# Altium schematic sheet GSM-Arduino-Custom-Board.SchDoc
size A2; Organization: Altium Limited; Address1: L3, 12a Rodborough Rd; Address2: Frenchs Forest; Address3: NSW; Address4: Australia 2086
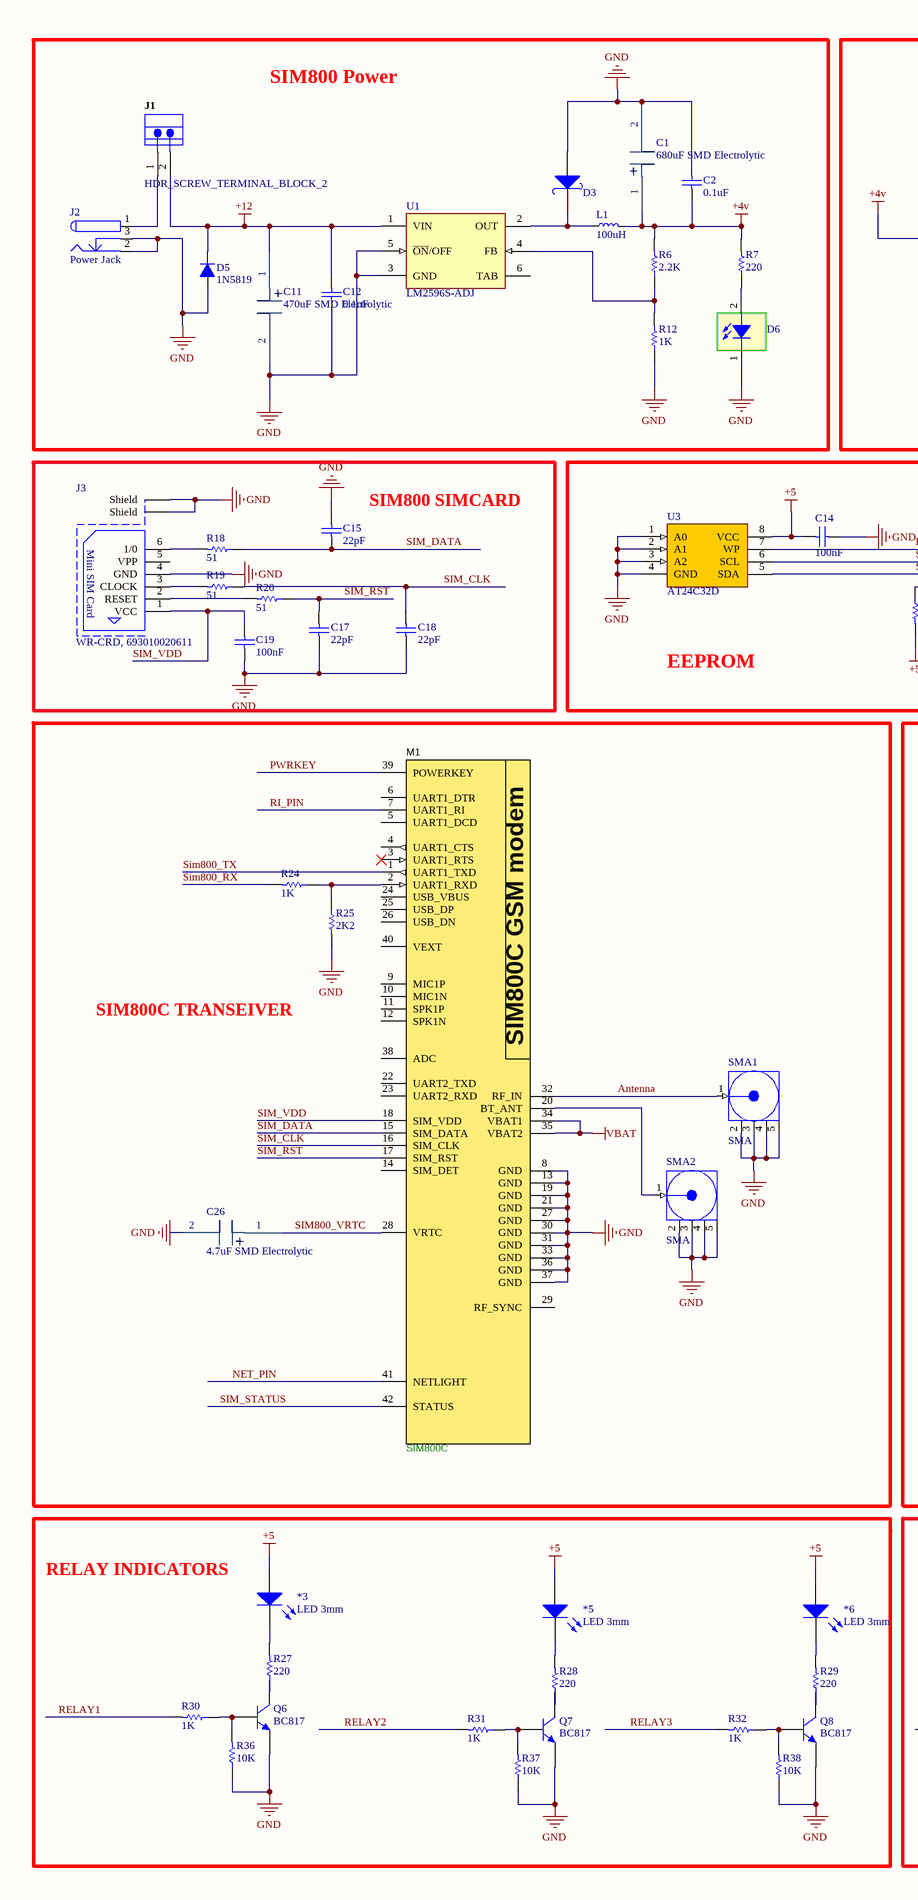
[diagram p0: GSM-Arduino-Custom-Board.SchDoc, left]
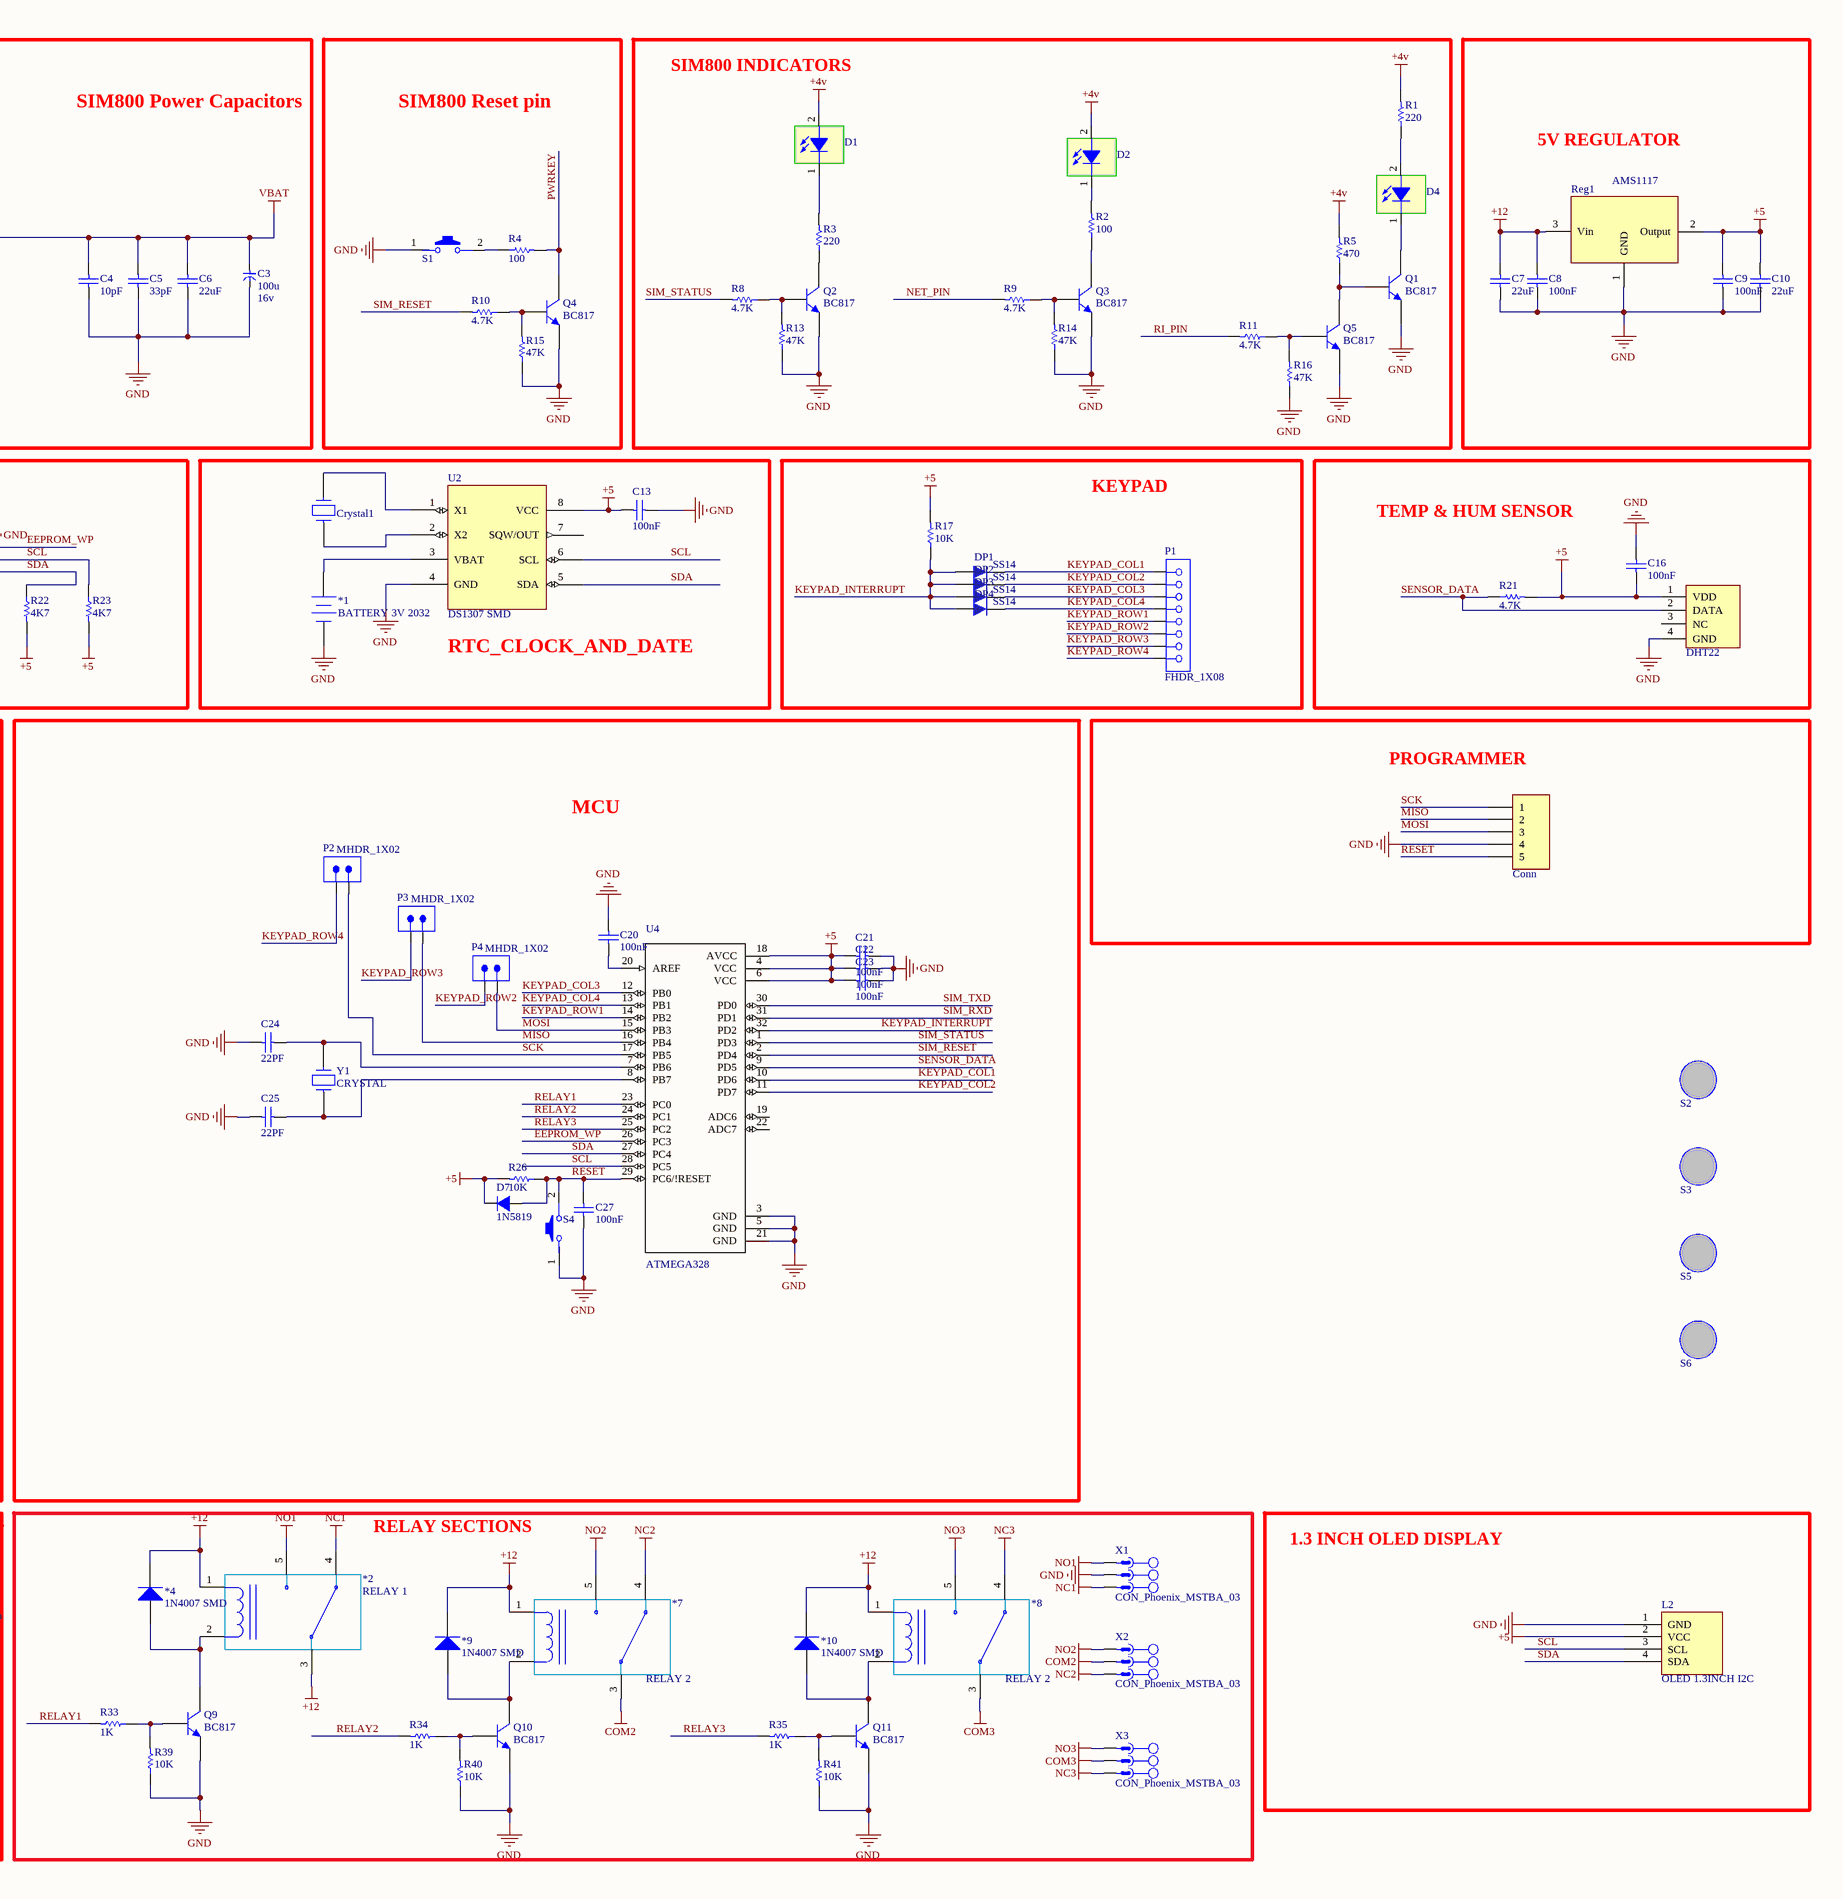
[diagram p1: GSM-Arduino-Custom-Board.SchDoc, right]

## Parts
*1  BATTERY 3V 2032  [batt]
*2  RELAY 1  [relay 3]
*3  LED 3mm  [led 3mm]
*4  1N4007 SMD  [1N4007 SMD]
*5  LED 3mm  [led 3mm]
*6  LED 3mm  [led 3mm]
*7  RELAY 2  [relay 3]
*8  RELAY 2  [relay 3]
*9  1N4007 SMD  [1N4007 SMD]
*10  1N4007 SMD  [1N4007 SMD]
C1  680uF SMD Electrolytic  [SMD Electrolytic Capacitor 8 x 10.2]
C2  0.1uF  [CAPC4817X12N]
C3  100u  Power: 16v  [TANTAL CAPACITOR SMD B]
C4  10pF  [CAPC4817X12N]
C5  33pF  [CAPC4817X12N]
C6  22uF  [CAPC4817X12N]
C7  22uF  [CAPC4817X12N]
C8  100nF  [CAPC4817X12N]
C9  100nF  [CAPC4817X12N]
C10  22uF  [CAPC4817X12N]
C11  470uF SMD Electrolytic  [SMD Electrolytic Capacitor 8 x 10.2]
C12  0.1uF  [CAPC4817X12N]
C13  100nF  [CAPC4817X12N]
C14  100nF  [CAPC4817X12N]
C15  22pF  [CAPC4817X12N]
C16  100nF  [CAPC4817X12N]
C17  22pF  [CAPC4817X12N]
C18  22pF  [CAPC4817X12N]
C19  100nF  [CAPC4817X12N]
C20  100nF  [CAPC4817X12N]
C21  100nF  [CAPC4817X12N]
C22  100nF  [CAPC4817X12N]
C23  100nF  [CAPC4817X12N]
C24  22PF  [CAPC4817X12N]
C25  22PF  [CAPC4817X12N]
C26  4.7uF SMD Electrolytic  [SMD Electrolytic Capacitor 4x5.2]
C27  100nF  [CAPC4817X12N]
Conn  Telecommunications  [Teleconn_5pin]  (value not drawn)
Crystal1  Crystal  [Crystal_2]  (value not drawn)
D1  SMD 1206 LED  [LED 1206]  (value not drawn)
D2  SMD 1206 LED  [LED 1206]  (value not drawn)
D3  1n5822  [DO-214AB(SMC)]  (value not drawn)
D4  SMD 1206 LED  [LED 1206]  (value not drawn)
D5  1N5819  [DO-214AC]
D6  SMD 1206 LED  [LED 1206]  (value not drawn)
D7  1N5819  [DO-214AC]
DHT22  DHT22  [DHT22]  (value not drawn)
DP1  SS14  [430X270D]
DP2  SS14  [430X270D]
DP3  SS14  [430X270D]
DP4  SS14  [430X270D]
J1  HDR_SCREW_TERMINAL_BLOCK_2  [Socket Blue 2]
J2  Power Jack  [Power Jack]
J3  WR-CRD, 693010020611  [693010020611]
L1  100uH  [inductor smd]
L2  OLED 1.3INCH I2C  [OLED 1.3INCH I2C]
M1  SIM800C  [SIM800C]
P1  FHDR_1X08  [FHDR1X08-254P]
P2  MHDR_1X02  [MHDR1X02-254P]
P3  MHDR_1X02  [MHDR1X02-254P]
P4  MHDR_1X02  [MHDR1X02-254P]
Q1  BC817  [SOT23_N]
Q2  BC817  [SOT23_N]
Q3  BC817  [SOT23_N]
Q4  BC817  [SOT23_N]
Q5  BC817  [SOT23_N]
Q6  BC817  [SOT23_N]
Q7  BC817  [SOT23_N]
Q8  BC817  [SOT23_N]
Q9  BC817  [SOT23_N]
Q10  BC817  [SOT23_N]
Q11  BC817  [SOT23_N]
R1  220  [RESC4817X04N]
R2  100  [RESC4817X04N]
R3  220  [RESC4817X04N]
R4  100  [RESC4817X04N]
R5  470  [RESC4817X04N]
R6  2.2K  [RESC4817X04N]
R7  220  [RESC4817X04N]
R8  4.7K  [RESC4817X04N]
R9  4.7K  [RESC4817X04N]
R10  4.7K  [RESC4817X04N]
R11  4.7K  [RESC4817X04N]
R12  1K  [RESC4817X04N]
R13  47K  [RESC4817X04N]
R14  47K  [RESC4817X04N]
R15  47K  [RESC4817X04N]
R16  47K  [RESC4817X04N]
R17  10K  [RESC4817X04N]
R18  51  [RESC4817X04N]
R19  51  [RESC4817X04N]
R20  51  [RESC4817X04N]
R21  4.7K  [RESC4817X04N]
R22  4K7  [RESC4817X04N]
R23  4K7  [RESC4817X04N]
R24  1K  [RESC4817X04N]
R25  2K2  [RESC4817X04N]
R26  10K  [RESC4817X04N]
R27  220  [RESC4817X04N]
R28  220  [RESC4817X04N]
R29  220  [RESC4817X04N]
R30  1K  [RESC4817X04N]
R31  1K  [RESC4817X04N]
R32  1K  [RESC4817X04N]
R33  1K  [RESC4817X04N]
R34  1K  [RESC4817X04N]
R35  1K  [RESC4817X04N]
R36  10K  [RESC4817X04N]
R37  10K  [RESC4817X04N]
R38  10K  [RESC4817X04N]
R39  10K  [RESC4817X04N]
R40  10K  [RESC4817X04N]
R41  10K  [RESC4817X04N]
Reg1  AMS1117  [AMS1117 3.3]
S1  SW_PB2  [SMD_ALPS_SKQMBBE010]  (value not drawn)
S2  Screw  [MY_PAD_3MM]  (value not drawn)  (net tie, no BOM)
S3  Screw  [MY_PAD_3MM]  (value not drawn)  (net tie, no BOM)
S4  SW_PB2  [SMD_ALPS_SKQMBBE010]  (value not drawn)
S5  Screw  [MY_PAD_3MM]  (value not drawn)  (net tie, no BOM)
S6  Screw  [MY_PAD_3MM]  (value not drawn)  (net tie, no BOM)
SMA1  SMA  [SMA ANT]
SMA2  SMA  [SMA ANT]
U1  LM2596S-ADJ  [TS5B_N]
U2  DS1307 SMD  [DS1307 SMD - SO-8]
U3  AT24C32D  [SO8]
U4  ATMEGA328  [QFP80P900X900X120-32N]
X1  CON_Phoenix_MSTBA_03  [CON_MSTBA03]
X2  CON_Phoenix_MSTBA_03  [CON_MSTBA03]
X3  CON_Phoenix_MSTBA_03  [CON_MSTBA03]
Y1  CRYSTAL  [My_Crystal_SMD]

## Blocks framed on the sheet
SIM800 Power: C1 C2 C11 C12 D3 D5 D6 J1 J2 L1 R6 R7 R12 U1
SIM800 Power Capacitors: C3-C6
SIM800 Reset pin: Q4 R4 R10 R15 S1
SIM800 INDICATORS: D1 D2 D4 Q1-Q3 Q5 R1-R3 R5 R8 R9 R11 R13 R14 R16
5V REGULATOR: C7-C10 Reg1
SIM800 SIMCARD: C15 C17-C19 J3 R18-R20
EEPROM: C14 R22 R23 U3
RTC_CLOCK_AND_DATE: *1 C13 Crystal1 U2
KEYPAD: DP1-DP4 P1 R17
TEMP & HUM SENSOR: C16 DHT22 R21
SIM800C TRANSEIVER: C26 M1 R24 R25 SMA1 SMA2
MCU: C20-C25 C27 D7 P2-P4 R26 S4 U4 Y1
PROGRAMMER: Conn
RELAY INDICATORS: *3 *5 *6 Q6-Q8 R27-R32 R36-R38
RELAY SECTIONS: *2 *4 *7-*10 Q9-Q11 R33-R35 R39-R41 X1-X3
1.3 INCH OLED DISPLAY: L2

## Nets
+4v: C1.1 C2.1 C3.1 C4.2 C5.2 C6.2 D1.2 D2.2 L1.2 M1.34(VBAT1) M1.35(VBAT2) R1.2 R5.2 R6.2 R7.2  [also labelled VBAT]
+5: *3.1(A) *5.1(A) *6.1(A) C9.2 C10.2 C13.2 C14.2 C16.1 C21.2 C22.2 C23.2 D7.1 DHT22.1(VDD) L2.2(VCC) R17.2 R21.2 R22.2 R23.2 R26.2 Reg1.2(Output) U2.8(VCC) U3.8(VCC) U4.4(VCC) U4.6(VCC) U4.18(AVCC)
+12: *2.1 *2.3 *4.2(K) *7.1 *8.1 *9.2(K) *10.2(K) C7.2 C8.2 C11.1 C12.2 D5.1 J1.2 Reg1.3(Vin) U1.1(VIN)
COM2: *7.3 X2.2
COM3: *8.3 X3.2
GND: *1.2(-) C1.2 C2.2 C3.2 C4.1 C5.1 C6.1 C7.1 C8.1 C9.1 C10.1 C11.2 C12.1 C13.1 C14.1 C15.1 C16.2 C17.2 C18.2 C19.1 C20.1 C21.1 C22.1 C23.1 C24.1 C25.1 C26.2 C27.2 Conn.4 D3.1(A) D5.2 D6.1 DHT22.4(GND) J2.2 J2.3 J3.4(GND) J3.Z1(Shield) J3.Z2(Shield) L2.1(GND) M1.8(GND) M1.13(GND) M1.19(GND) M1.21(GND) M1.27(GND) M1.30(GND) M1.31(GND) M1.33(GND) M1.36(GND) M1.37(GND) Q1.2(E) Q2.2(E) Q3.2(E) Q4.2(E) Q5.2(E) Q6.2(E) Q7.2(E) Q8.2(E) Q9.2(E) Q10.2(E) Q11.2(E) R12.1 R13.1 R14.1 R15.1 R16.1 R25.2 R36.1 R37.1 R38.1 R39.1 R40.1 R41.1 Reg1.1(GND) S1.1(Button) S4.1(Button) SMA1.2(GND) SMA1.3(GND) SMA1.4(GND) SMA1.5(GND) SMA2.2(GND) SMA2.3(GND) SMA2.4(GND) SMA2.5(GND) U1.3(GND) U1.5(~{ON}/OFF) U2.4(GND) U3.1(A0) U3.2(A1) U3.3(A2) U3.4(GND) U4.3(GND) U4.5(GND) U4.21(GND) X1.2
NC1: *2.4 X1.3
NC2: *7.4 X2.3
NC3: *8.4 X3.3
NO1: *2.5 X1.1
NO2: *7.5 X2.1
NO3: *8.5 X3.1
Antenna: M1.32(RF_IN) SMA1.1(Signal)
EEPROM_WP: U3.7(WP) U4.26(PC3)
KEYPAD_COL1: DP1.2 P1.1 U4.10(PD6)
KEYPAD_COL2: DP2.2 P1.2 U4.11(PD7)
KEYPAD_COL3: DP3.2 P1.3 U4.12(PB0)
KEYPAD_COL4: DP4.2 P1.4 U4.13(PB1)
KEYPAD_INTERRUPT: DP1.1 DP2.1 DP3.1 DP4.1 R17.1 U4.32(PD2)
KEYPAD_ROW1: P1.5 U4.14(PB2)
KEYPAD_ROW2: P1.6 P4.1
KEYPAD_ROW3: P1.7 P3.1
KEYPAD_ROW4: P1.8 P2.1
MISO: Conn.2 P3.2 U4.16(PB4)
MOSI: Conn.3 P4.2 U4.15(PB3)
NET_PIN: M1.41(NETLIGHT) R9.2
PWRKEY: M1.39(POWERKEY) Q4.3(C) R4.2
RELAY1: R30.2 R33.2 U4.23(PC0)
RELAY2: R31.2 R34.2 U4.24(PC1)
RELAY3: R32.2 R35.2 U4.25(PC2)
RESET: C27.1 Conn.5 D7.2 R26.1 S4.2 U4.29(PC6/!RESET)
RI_PIN: M1.7(UART1_RI) R11.2
SCK: Conn.1 P2.2 U4.17(PB5)
SCL: L2.3(SCL) R23.1 U2.6(SCL) U3.6(SCL) U4.28(PC5)
SDA: L2.4(SDA) R22.1 U2.5(SDA) U3.5(SDA) U4.27(PC4)
SENSOR_DATA: DHT22.2(DATA) R21.1 U4.9(PD5)
Sim800_RX: R24.2
Sim800_TX: M1.1(UART1_TXD)
SIM800_VRTC: C26.1 M1.28(VRTC)
SIM_CLK: C18.1 M1.16(SIM_CLK) R19.1
SIM_DATA: C15.2 M1.15(SIM_DATA) R18.1
SIM_RESET: R10.2 U4.2(PD4)
SIM_RST: C17.1 M1.17(SIM_RST) R20.1
SIM_RXD: U4.31(PD1)
SIM_STATUS: M1.42(STATUS) R8.2 U4.1(PD3)
SIM_TXD: U4.30(PD0)
SIM_VDD: C19.2 J3.1(VCC) M1.18(SIM_VDD)
Net*1_1: *1.1(+) U2.3(VBAT)
Net*2_2: *2.2 *4.1(A) Q9.3(C)
Net*3_2: *3.2(K) R27.2
Net*5_2: *5.2(K) R28.2
Net*6_2: *6.2(K) R29.2
Net*7_2: *7.2 *9.1(A) Q10.3(C)
Net*8_2: *8.2 *10.1(A) Q11.3(C)
NetC20_2: C20.2 U4.20(AREF)
NetC24_2: C24.2 U4.7(PB6) Y1.2
NetC25_2: C25.2 U4.8(PB7) Y1.1
NetCrystal1_1: Crystal1.1 U2.2(X2)
NetCrystal1_2: Crystal1.2 U2.1(X1)
NetD1_1: D1.1 R3.2
NetD2_1: D2.1 R2.2
NetD3_2: D3.2(K) L1.1 U1.2(OUT)
NetD4_1: D4.1 Q1.3(C)
NetD4_2: D4.2 R1.1
NetD6_2: D6.2 R7.1
NetJ1_1: J1.1 J2.1
NetJ3_2: J3.2(RESET) R20.2
NetJ3_3: J3.3(CLOCK) R19.2
NetJ3_6: J3.6(1/0) R18.2
NetM1_2: M1.2(UART1_RXD) R24.1 R25.1
NetM1_20: M1.20(BT_ANT) SMA2.1(Signal)
NetQ1_1: Q1.1(B) Q5.3(C) R5.1
NetQ2_1: Q2.1(B) R8.1 R13.2
NetQ2_3: Q2.3(C) R3.1
NetQ3_1: Q3.1(B) R9.1 R14.2
NetQ3_3: Q3.3(C) R2.1
NetQ4_1: Q4.1(B) R10.1 R15.2
NetQ5_1: Q5.1(B) R11.1 R16.2
NetQ6_1: Q6.1(B) R30.1 R36.2
NetQ6_3: Q6.3(C) R27.1
NetQ7_1: Q7.1(B) R31.1 R37.2
NetQ7_3: Q7.3(C) R28.1
NetQ8_1: Q8.1(B) R32.1 R38.2
NetQ8_3: Q8.3(C) R29.1
NetQ9_1: Q9.1(B) R33.1 R39.2
NetQ10_1: Q10.1(B) R34.1 R40.2
NetQ11_1: Q11.1(B) R35.1 R41.2
NetR4_1: R4.1 S1.2
NetR6_1: R6.1 R12.2 U1.4(FB)

Not connected (* = marked no-connect by the designer): DHT22 3(NC); J3 5(VPP); M1 3(UART1_RTS)* 4(UART1_CTS) 5(UART1_DCD) 6(UART1_DTR) 9(MIC1P) 10(MIC1N) 11(SPK1P) 12(SPK1N) 14(SIM_DET) 22(UART2_TXD) 23(UART2_RXD) 24(USB_VBUS) 25(USB_DP) 26(USB_DN) 29(RF_SYNC) 38(ADC) 40(VEXT); U1 6(TAB); U2 7(SQW/OUT); U4 19(ADC6) 22(ADC7)

## Notes on the sheet
- Title
- Size:
- Date:
- File:
- A2
- Number:
- Time:
- Revision:
- Sheet
- of
- (in symbol SIM800C) SIM800C GSM modem
- (in symbol WR-CRD, 693010020611) Mini SIM Card

## Library data of the parts
*7 *8 = RELAY 1
C1 C11 C26 = SMD Electrolytic Capacitor 8 x 10.2
C2 C4-C10 C12-C25 C27 = CAP SMD 1206: CAP 1206; Designer: Abbas Basereh; Desc.: CAP SMD 1206; Data: 16-12-2016
C3 = TANTAL CAP SMD B: TANTAL CAPACITOR; Designer: Danial mirzaei
Conn = CON_Telecommunications_5pin: LatestRevisionDate: 17-Jul-2002; LatestRevisionNote: Re-released for DXP Platform.; Publisher: Altium Limited
Crystal1 = Crystal..: LatestRevisionDate: 17-Jul-2002; LatestRevisionNote: Re-released for DXP Platform.; Publisher: Altium Limited
D1 D2 D4 D6 = LED SMD 1206
D3 = 1N5822 SMD: Schottky Rectifiers; Part. No: SS34; Manufacturer: ON Semiconductor/Fairchild; Designer: Abbas Basereh; Link: https://www.aliexpress.com/item/Free-shipping-100pcs-1n5822-sma-smd-do-214ac-Schottky-diode-ss34/32337482329.html?spm=2114.01010208.3.1.zLZDsP&ws_ab_test=searchweb0_0,searchweb201602_4_10065_10068_10084_10083_10080_10082_10081_10060_10061_10062_10056_10055_10054_10059_10099_10078_10079_427_10073_10103_10102_10096_10052_10050_10051,searchweb201603_4&btsid=6e50dc92-ac69-45bc-a19e-209af19ce602; Link: http://www.tme.eu/en/details/ss34/smd-schottky-diodes/vishay/ss34-e357t/; Link: http://www.digikey.com/product-detail/en/on-semiconductor-fairchild/SS34/SS34FSCT-ND/2094459; Data: 16-12-2016
D5 D7 = 1N5819: Schottky diode
DHT22 = DHT22: Temprature & Humidity Sensor
DP1-DP4 = 1N5819: Schottkey Rectifiers; Designer: Abbas Basereh; Data: 16-12-2016; Link: *; Part. No: *
J1 = HDR_SCREW_TERMINAL_BLOCK_2: Connector type: Header; Max Current: 300V/10A A; designer: Eng. Saeid Jorablo; Company: SJ Libraries; Mounting Technology: Through-Hole; Pin Count: 12; Status: Unreleased; Category: Headers; Publisher: SJ UnLimited; Supplier 1: Digi-Key; ComponentLink1Description: Datasheet; ComponentLink2Description: Reference; Update: 7/8/2012; Supplier Part Number 1: 1776257-2-ND; HelpURL: http://s3.picofile.com/file/7443264187/Coming_Soon_logo.gif
J2 = Power Jack: Designer: Saeid Jorablo; Company: Personal; Project Name: Laser; Adding Date: 10/21/2009
J3 = WR-CRD, 693010020611: WR-CRD Mini SIM; Manufacturer: Würth Elektronik eiSos GmbH; ComponentLink1 Description: Manufacturer; ComponentLink2 Description: Datasheet; NoPins: 6; ComponentLink1URL: http://www.we-online.de; ComponentLink2URL: http://katalog.we-online.de/em/datasheet/693010020611.pdf; Created by: Karrer Zheng; Created Date: 10/10/2014; partNo: 693010020611
L1 = inductor smd: Made By Danial Mirzaei; PACKAGE: SMT
L2 = OLED 1.3 INCH LCD I2C
P1 = FHDR_1X08: Female Header 1X08
P2-P4 = MHDR_1X02: Male Header 1X02
Q1-Q11 = BC817: 45 V, 500 mA NPN general-purpose transistors; Published: 2017-2-8; LatestRevisionDate: 2017; LatestRevisionNote: IPC-7351 Footprint Added.; DatasheetVersion: 2017; PackageVersion: 2017-2-8; PackageReference: SOT23; Publisher: Abbas Basereh; PackageDescription: 3-Pin SOT-23 Package 0.95 mm Pitch, 2.3 mm Lead Span; ComponentLink1Description: Manufacturer Link; ComponentLink1URL: http://www.nxp.com/; ComponentLink2Description: Datasheet; ComponentLink2URL: http://www.nxp.com/
R1-R41 = RES 1206 0.25W: RES 1206; Designer: Abbas Basereh; Desc.: RES SMD 1206; Data: 16-12-2016
S1 S4 = SW_PB2: 2 Pin Push Button Switch; Company: SJ Libraries; Designer: Eng. Saeid Jorablo; Mounting Technology: Surface Mount\Through-Hole; ComponentLink1Description: Datasheet; Pin Count: 0; Update Date: 6/3/2012; Category: MISC; HelpURL: http://s3.picofile.com/file/7443264187/Coming_Soon_logo.gif
S2 S3 S5 S6 = Screw: 3mm Screw
U1 = LM2596S-ADJ: SIMPLE SWITCHER Power Converter 150 KHz 3A Step-Down Voltage Regulator; Manufacturer: National Semiconductor; PackageTopMarking: NSUZXYTT*LM2596S*-ADJ P+; PowerWise: N; FirstPublished: 4-Dec-2008; DatasheetVersion: May-2002; PackageVersion: revD, Apr-2005; PackageReference: TS5B; Publisher: Altium Limited; PackageDescription: TO-263, Molded, .400 x .390 x .180in, 5 Lead, .067in Pitch, Surface Mount; CompType: Switcher; PartNumber: LM2596S-ADJ; RoHS: O; PinCount: 5; DigiKeyPartNumber: LM2596S-ADJ-ND; Code_JEDEC: MO-169-AB; ComponentLink1Description: LM2596 Datasheet; ComponentLink1URL: http://www.national.com/ds/LM/LM2596.pdf; ComponentLink2Description: LM2596 Web Page; ComponentLink2URL: http://www.national.com/pf/LM/LM2596.html; ComponentLink3Description: TS5B Package Page; ComponentLink3URL: http://www.national.com/packaging/folders/ts5b.html
U2 = DS1307 SMD: DS1307 SMD SO-8 By Reza.K.H
U3 = AT24C32D: 2-Wire Serial  Electrically  Erasable and  Programmable  Read-only  Memory
U4 = ATMEGA328-smd: MCU 8-bit ATmega AVR RISC 32KB Flash 2.5V/3.3V/5V 32-Pin TQFP Tray; MF: Microchip; MP: ATMEGA328P-AN; SnapEDA_Link: https://www.snapeda.com/parts/ATMEGA328P-AN/Microchip/view-part/?ref=snap; Price: 2.11 USD; Package: TQFP-32 Microchip; Availability: Warning; Value: *
X1-X3 = CON_Phoenix_MSTBA_03: Manufacturer: PHOENIX CONTACT; Company: SJ Libraries; Connector type: PCB Terminal Block; designer: Eng. Saeid Jorablo; Max Current: 12 A; Positions: 3; Revision 1: 2012/10/1 : Adding Model; Voltage: 320 V; Category: Connector; ComponentLink1Description: Datasheet; ComponentLink2Description: Reference; HelpURL: http://s3.picofile.com/file/7443264187/Coming_Soon_logo.gif; Mounting Technology: Through-Hole; Pin Count: 3; Publisher: SJ UnLimited; Status: Unreleased; Update: 2012/10/1
Y1 = CRYSTAL: ASiD Part Number: Crystal-AS